# Altium project 2221_ProjetPCB.PrjPcb
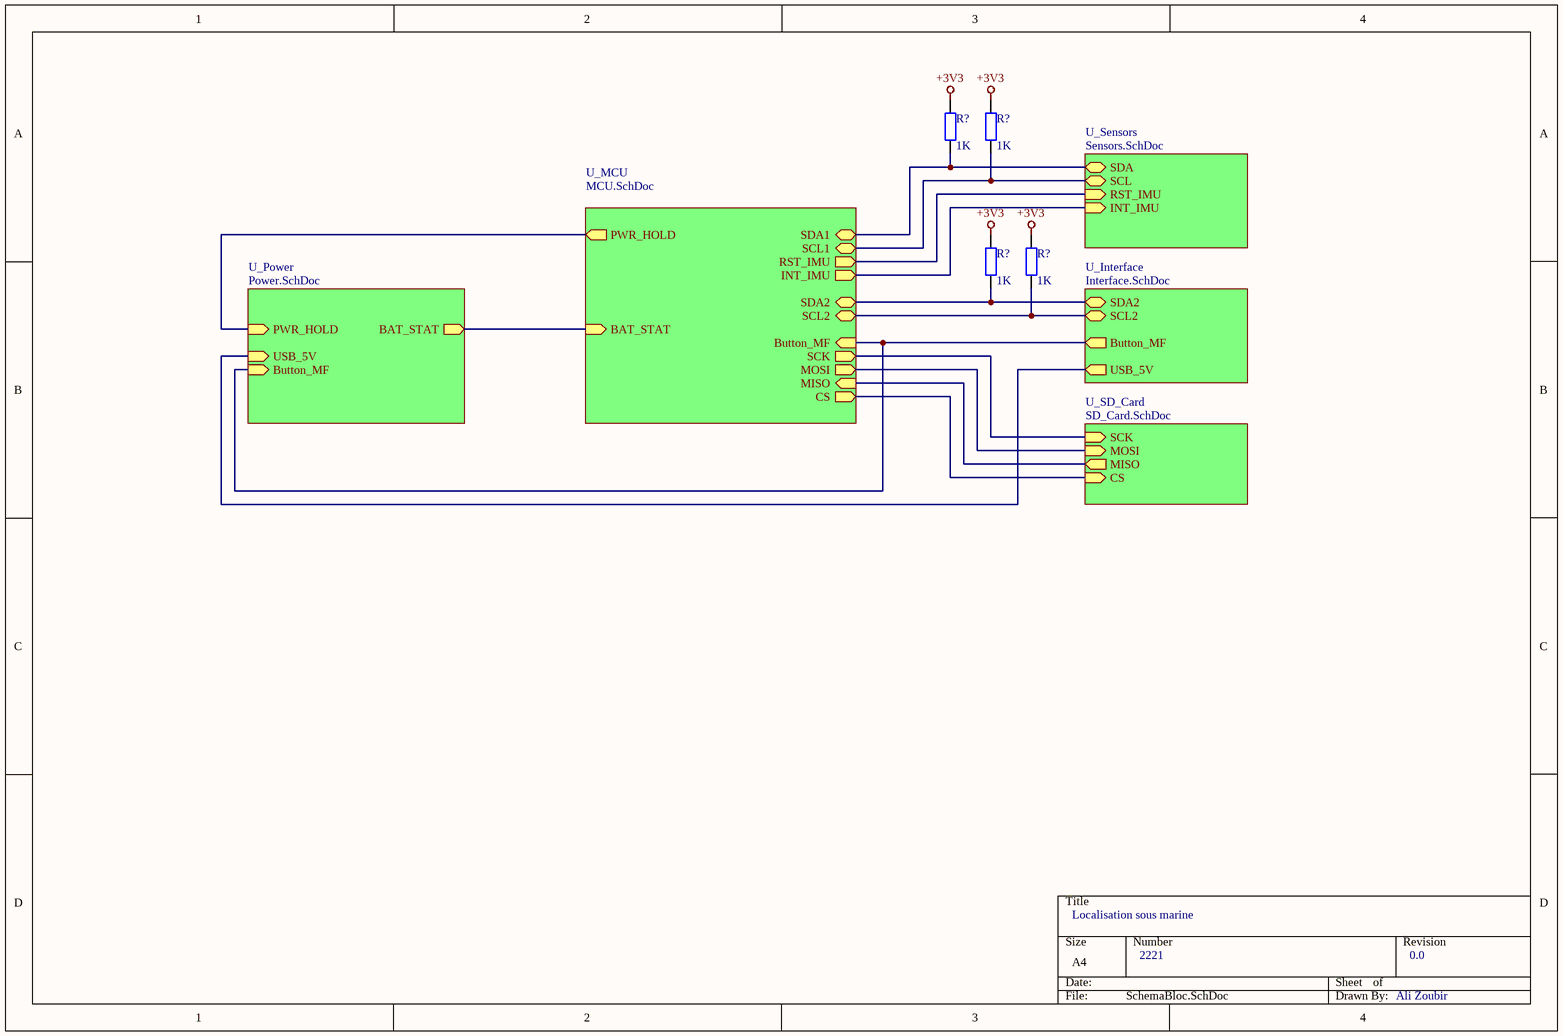
[diagram p0: SchemaBloc.SchDoc]
6 sheets, 33 parts. Net scope: hierarchical (ports join the sheet entries above them; power ports are global).
Sheets:
  SchemaBloc.SchDoc
    U_MCU = MCU.SchDoc
    U_Interface = Interface.SchDoc
    U_Power = Power.SchDoc
    U_SD_Card = SD_Card.SchDoc
    U_Sensors = Sensors.SchDoc

## Sheet SchemaBloc.SchDoc: Localisation sous marine
size A4; Author: Ali Zoubir; DrawnBy: Ali Zoubir; Engineer: Ali Zoubir; Organization: ETML-ES; Revision: 0.0; SheetNumber: 1; SheetTotal: 6

### Parts
(Parts that share a designator on the sheet are numbered #1, #2 ... from top to bottom, then left to right.)
R?#1  value 1K  [AXIAL-0.4]
R?#2  value 1K  [AXIAL-0.4]
R?#3  value 1K  [AXIAL-0.4]
R?#4  value 1K  [AXIAL-0.4]

### Sub-sheets
U_Interface = Interface.SchDoc: SDA2 (bidir), SCL2 (bidir), Button_MF (out), USB_5V (out)
U_MCU = MCU.SchDoc: SDA1 (bidir), SCL1 (bidir), Button_MF (in), SCK (out), MOSI (out), MISO (in), CS (out), BAT_STAT (in), RST_IMU (out), INT_IMU (out), PWR_HOLD (out), SDA2 (bidir), SCL2 (bidir)
U_Power = Power.SchDoc: BAT_STAT (out), PWR_HOLD (in), Button_MF (in), USB_5V (in)
U_SD_Card = SD_Card.SchDoc: SCK (in), MOSI (in), MISO (out), CS (in)
U_Sensors = Sensors.SchDoc: SDA (bidir), SCL (bidir), RST_IMU (in), INT_IMU (in)

### Nets
+3V3: R?#1.2 R?#2.2 R?#3.2 R?#4.2
RA0_CS: sheet U_MCU/CS, sheet U_SD_Card/CS
RA1_SCK: sheet U_MCU/SCK, sheet U_SD_Card/SCK
RA2_MOSI: sheet U_MCU/MOSI, sheet U_SD_Card/MOSI
RA3_MISO: sheet U_MCU/MISO, sheet U_SD_Card/MISO
RB2_SDA2: R?#4.1 ; sheet U_MCU/SCL2, sheet U_Interface/SCL2
RB3_SCL2: R?#3.1 ; sheet U_MCU/SDA2, sheet U_Interface/SDA2
RB6_RstImu: sheet U_MCU/RST_IMU, sheet U_Sensors/RST_IMU
RB7_IntImu: sheet U_MCU/INT_IMU, sheet U_Sensors/INT_IMU
RB8_SCL1: R?#2.1 ; sheet U_MCU/SCL1, sheet U_Sensors/SCL
RB9_SDA1: R?#1.1 ; sheet U_MCU/SDA1, sheet U_Sensors/SDA
RC0_ButtonMF: sheet U_MCU/Button_MF, sheet U_Interface/Button_MF, sheet U_Power/Button_MF
RC1_PwrHold: sheet U_MCU/PWR_HOLD, sheet U_Power/PWR_HOLD
RC2_BatStat: sheet U_MCU/BAT_STAT, sheet U_Power/BAT_STAT
(unnamed): sheet U_Interface/USB_5V, sheet U_Power/USB_5V

### Notes on the sheet
- 2221

### Library data of the parts
R?#1-R?#4 = Res2: Resistor; Published: 8-Jun-2000; LatestRevisionDate: 17-Jul-2002; LatestRevisionNote: Re-released for DXP Platform.; PackageReference: AXIAL-0.4; Publisher: Altium Limited; PackageDescription: Axial Device, Thru-Hole; 2 Leads; 0.4 in Pin Spacing

## Sheet MCU.SchDoc: Localisation sous marine
size A4; Author: Ali Zoubir; CompanyName: ETML-ES; Engineer: Ali Zoubir; Organization: ETML-ES; Revision: 0.0; SheetNumber: 2; SheetTotal: 6
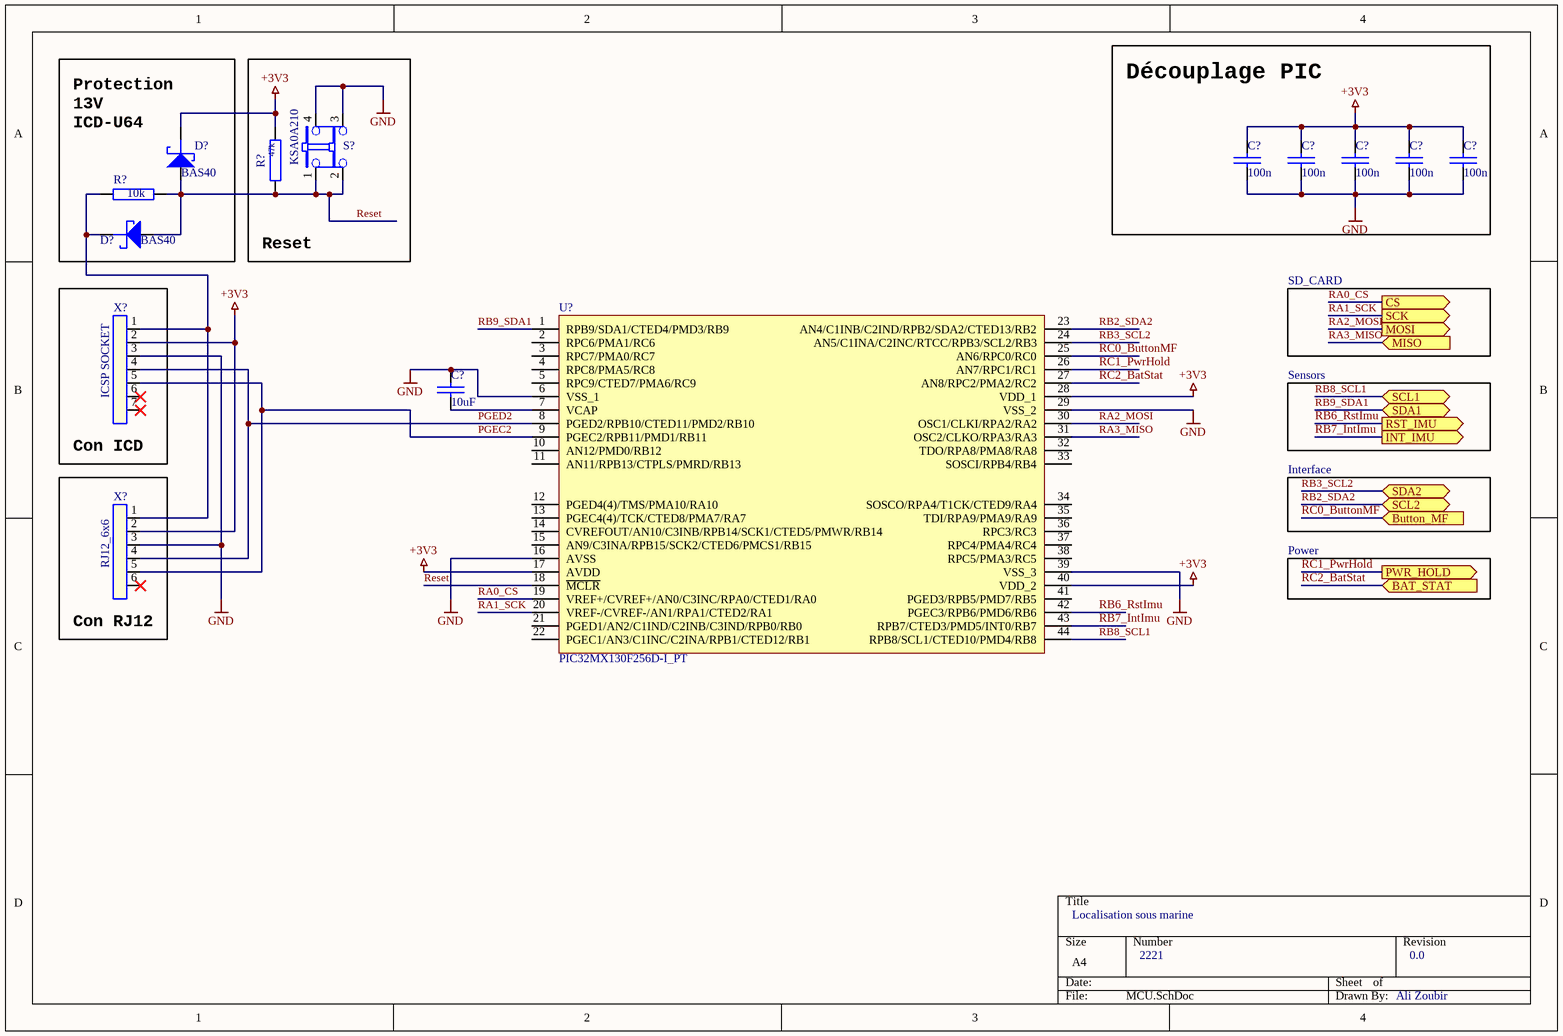
[diagram p1: MCU.SchDoc]

### Parts
(Parts that share a designator on the sheet are numbered #1, #2 ... from top to bottom, then left to right.)
C?#1  100n  [RC0805]
C?#2  100n  [RC0805]
C?#3  100n  [RC0805]
C?#4  100n  [RC0805]
C?#5  100n  [RC0805]
C?#6  10uF  [RC0805]
D?#1  BAS40  [BAS40]
D?#2  BAS40  [BAS40]
R?#5  47k  [RC0805]
R?#6  10k  [RC0805]
S?  KSA0A210  [6x6_mm_SMD_WS-TASV]
U?#1  PIC32MX130F256D-I_PT  [QFP80P1200X1200X120-44N]
X?#1  ICSP SOCKET  [Mini-berg1x7]
X?#2  RJ12_6x6  [RJ12_66_coude_verr_bas]

### Blocks framed on the sheet
Reset: R?#5 S?
Découplage PIC: C?#1-C?#5
Con ICD: X?#1
Con RJ12: X?#2

### Ports
BAT_STAT (in, see SchemaBloc[2B]), Button_MF (in, see SchemaBloc[3B], Interface[1A]), CS (out, see SchemaBloc[3B]), INT_IMU (out, see SchemaBloc[3B]), MISO (in, see SchemaBloc[3B]), MOSI (out, see SchemaBloc[3B]), PWR_HOLD (out, see SchemaBloc[2A]), RST_IMU (out, see SchemaBloc[3B]), SCK (out, see SchemaBloc[3B]), SCL1 (bidir, see SchemaBloc[3A]), SCL2 (bidir, see SchemaBloc[3B], Interface[1A]), SDA1 (bidir, see SchemaBloc[3A]), SDA2 (bidir, see SchemaBloc[3B], Interface[1A])

### Nets
+3V3: C?#1.1 C?#2.1 C?#3.1 C?#4.1 C?#5.1 D?#1.3(K) R?#5.1 U?#1.17(AVDD) U?#1.28(VDD_1) U?#1.40(VDD_2) X?#1.2 X?#2.2
GND: C?#1.2 C?#2.2 C?#3.2 C?#4.2 C?#5.2 C?#6.1 S?.3 S?.4 U?#1.6(VSS_1) U?#1.16(AVSS) U?#1.29(VSS_2) U?#1.39(VSS_3) X?#1.3 X?#2.3
PGEC2: U?#1.9(PGEC2/RPB11/PMD1/RB11) X?#1.5 X?#2.5
PGED2: U?#1.8(PGED2/RPB10/CTED11/PMD2/RB10) X?#1.4 X?#2.4
RA0_CS: U?#1.19(VREF+/CVREF+/AN0/C3INC/RPA0/CTED1/RA0) ; port CS
RA1_SCK: U?#1.20(VREF-/CVREF-/AN1/RPA1/CTED2/RA1) ; port SCK
RA2_MOSI: U?#1.30(OSC1/CLKI/RPA2/RA2) ; port MOSI
RA3_MISO: U?#1.31(OSC2/CLKO/RPA3/RA3) ; port MISO
RB2_SDA2: U?#1.23(AN4/C1INB/C2IND/RPB2/SDA2/CTED13/RB2) ; port SCL2
RB3_SCL2: U?#1.24(AN5/C1INA/C2INC/RTCC/RPB3/SCL2/RB3) ; port SDA2
RB6_RstImu: U?#1.42(PGEC3/RPB6/PMD6/RB6) ; port RST_IMU
RB7_IntImu: U?#1.43(RPB7/CTED3/PMD5/INT0/RB7) ; port INT_IMU
RB8_SCL1: U?#1.44(RPB8/SCL1/CTED10/PMD4/RB8) ; port SCL1
RB9_SDA1: U?#1.1(RPB9/SDA1/CTED4/PMD3/RB9) ; port SDA1
RC0_ButtonMF: U?#1.25(AN6/RPC0/RC0) ; port Button_MF
RC1_PwrHold: U?#1.26(AN7/RPC1/RC1) ; port PWR_HOLD
RC2_BatStat: U?#1.27(AN8/RPC2/PMA2/RC2) ; port BAT_STAT
Reset: D?#1.1(A) D?#2.1(A) R?#5.2 R?#6.2 S?.1 S?.2 U?#1.18(~{MCLR})
NetC?#6_2: C?#6.2 U?#1.7(VCAP)
NetD?#2_3: D?#2.3(K) R?#6.1 X?#1.1 X?#2.1

Not connected (* = marked no-connect by the designer): U?#1 2(RPC6/PMA1/RC6) 3(RPC7/PMA0/RC7) 4(RPC8/PMA5/RC8) 5(RPC9/CTED7/PMA6/RC9) 10(AN12/PMD0/RB12) 11(AN11/RPB13/CTPLS/PMRD/RB13) 12(PGED4(4)/TMS/PMA10/RA10) 13(PGEC4(4)/TCK/CTED8/PMA7/RA7) 14(CVREFOUT/AN10/C3INB/RPB14/SCK1/CTED5/PMWR/RB14) 15(AN9/C3INA/RPB15/SCK2/CTED6/PMCS1/RB15) 21(PGED1/AN2/C1IND/C2INB/C3IND/RPB0/RB0) 22(PGEC1/AN3/C1INC/C2INA/RPB1/CTED12/RB1) 32(TDO/RPA8/PMA8/RA8) 33(SOSCI/RPB4/RB4) 34(SOSCO/RPA4/T1CK/CTED9/RA4) 35(TDI/RPA9/PMA9/RA9) 36(RPC3/RC3) 37(RPC4/PMA4/RC4) 38(RPC5/PMA3/RC5) 41(PGED3/RPB5/PMD7/RB5); X?#1 6* 7*; X?#2 6*

### Notes on the sheet
- (near D?#1) Protection
  13V
  ICD-U64
- SD_CARD
- Sensors
- Interface
- Power
- 2221

### Library data of the parts
C?#1-C?#6 = C: SDTSourceLibName: C:\WINDOWS\TEMP\DA.LIB; PCB Footprint: RC0805
D?#1 D?#2 = BAS40_0: NC: 2; PCB Footprint: BAS40
R?#5 = R: SDTSourceLibName: N:\APP\ORCADWIN\EXPRESS\LIBRARY\ETML_LIB\R_FILMME; COMPSIDE: TOP; COMPLOC: [850.000,-625.000]; COMPROT: 270; COMPGROUP: 0; COMPFIXED: NO; COMPHEIGHT: 0.000; PCB Footprint: RC0805; COMPLOCKED: NO; COMPKEY: NO; DECOUPLER: NO; MEMORY: NO
R?#6 = R: SDTSourceLibName: N:\APP\ORCADWIN\EXPRESS\LIBRARY\ETML_LIB\R_FILMME; COMPHEIGHT: 0.000; MEMORY: NO; COMPGROUP: 0; COMPROT: 270; COMPLOC: [4375.000,-300.000]; COMPSIDE: TOP; PCB Footprint: RC0805; DECOUPLER: NO; COMPKEY: NO; COMPLOCKED: NO; COMPFIXED: NO
U?#1 = PIC32MX130F256D-I_PT: Microchip PIC32MX130F256D-I/PT, 32bit PIC Microcontroller, 40MHz, 256 kB Flash, 44-Pin TQFP; Geometry.Height: 1.2mm; Mouser Part Number: 579-MX130F256DIPT; Mouser Price/Stock: https://www.mouser.co.uk/ProductDetail/Microchip-Technology/PIC32MX130F256D-I-PT?qs=XR%2FfMt4sL%252BEhDQElh0Q%2FjQ%3D%3D; Manufacturer_Name: Microchip; Manufacturer_Part_Number: PIC32MX130F256D-I/PT; Datasheet Link: https://componentsearchengine.com/Datasheets/5/PIC32MX130F256D-I_PT.pdf
X?#1 = Berg 7p: COMPSIDE: TOP; COMPLOC: [5575.000,-150.000]; COMPROT: 0; COMPFIXED: NO; COMPHEIGHT: 10.000; COMPGROUP: 0; COMPLOCKED: NO; COMPKEY: NO; DECOUPLER: NO; MEMORY: NO; PCB Footprint: Mini-berg1x7
X?#2 = RJ12: COMPSIDE: TOP; COMPLOC: [5225.000,-550.000]; COMPROT: 0; COMPFIXED: NO; COMPHEIGHT: 0.000; COMPGROUP: 0; COMPLOCKED: NO; COMPKEY: NO; DECOUPLER: NO; MEMORY: NO; PCB Footprint: RJ12_66_coude_verr_bas
S? = KSA0A210: PCB Footprint: 6x6_mm_SMD_WS-TASV

## Sheet Interface.SchDoc
size A4; SheetNumber: 4; SheetTotal: 6
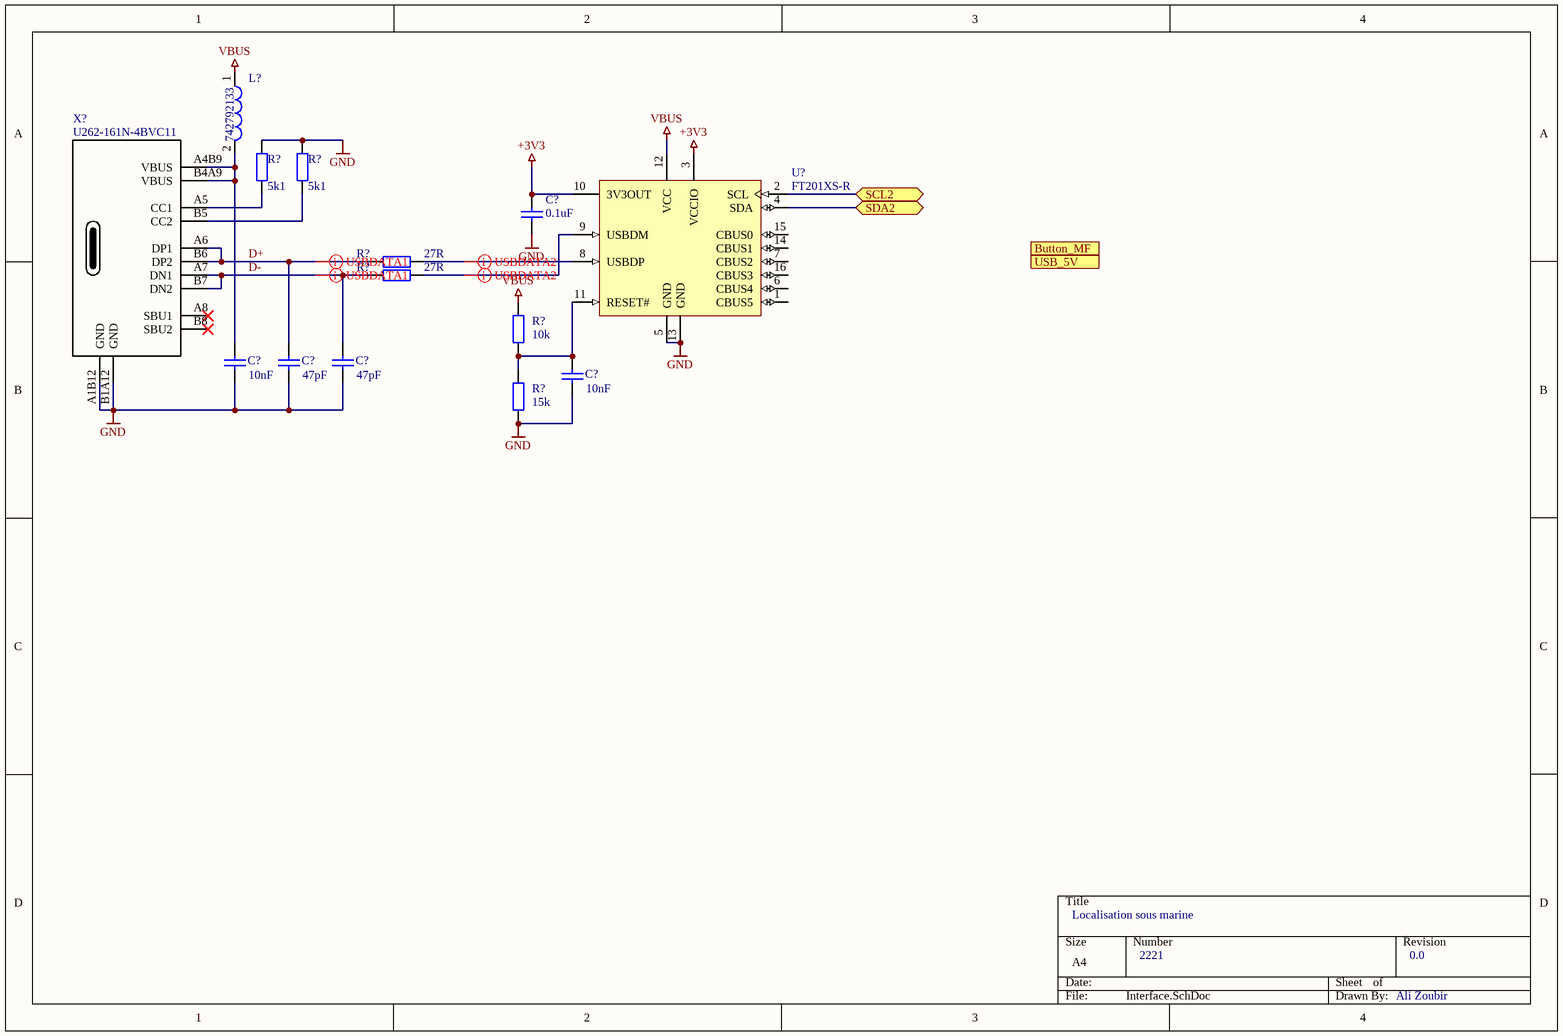
[diagram p2: Interface.SchDoc]

### Parts
(Parts that share a designator on the sheet are numbered #1, #2 ... from top to bottom, then left to right.)
C?#7  value 0.1uF  [6-0805_L]  (hidden comment: Cap)
C?#8  value 10nF  [6-0805_L]  (hidden comment: Cap)
C?#9  value 47pF  [6-0805_L]  (hidden comment: Cap)
C?#10  value 47pF  [6-0805_L]  (hidden comment: Cap)
C?#11  value 10nF  [6-0805_L]  (hidden comment: Cap)
L?  742792133  [SMD-1206]
R?#7  value 5k1  [AXIAL-0.4]  (hidden comment: Res2)
R?#8  value 5k1  [AXIAL-0.4]  (hidden comment: Res2)
R?#9  value 27R  [AXIAL-0.4]  (hidden comment: Res2)
R?#10  value 27R  [AXIAL-0.4]  (hidden comment: Res2)
R?#11  value 10k  [AXIAL-0.4]  (hidden comment: Res2)
R?#12  value 15k  [AXIAL-0.4]  (hidden comment: Res2)
U?#2  FT201XS-R  [SSOP-16_N]
X?#3  U262-161N-4BVC11  [GCT_USB4105-GF-A]

### Ports
Button_MF (out, see SchemaBloc[3B], MCU[4C]), SCL2 (bidir, see SchemaBloc[3B], MCU[4B]), SDA2 (bidir, see SchemaBloc[3B], MCU[4B]), USB_5V (out, see SchemaBloc[3B])

### Nets
+3V3: C?#7.2 U?#2.3(VCCIO) U?#2.10(3V3OUT)
GND: C?#7.1 C?#8.1 C?#9.1 C?#10.1 C?#11.1 R?#7.2 R?#8.2 R?#12.1 U?#2.5(GND) U?#2.13(GND) X?#3.A1B12(GND) X?#3.B1A12(GND)
VBUS: L?.1 R?#11.2 U?#2.12(VCC)
D+: C?#9.2 R?#9.1 X?#3.A6(DP1) X?#3.B6(DP2)
D-: C?#10.2 R?#10.1 X?#3.A7(DN1) X?#3.B7(DN2)
RB2_SDA2: U?#2.2(SCL) ; port SCL2
RB3_SCL2: U?#2.4(SDA) ; port SDA2
NetC?#8_2: C?#8.2 L?.2 X?#3.A4B9(VBUS) X?#3.B4A9(VBUS)
NetC?#11_2: C?#11.2 R?#11.1 R?#12.2 U?#2.11(RESET#)
NetR?#7_1: R?#7.1 X?#3.A5(CC1)
NetR?#8_1: R?#8.1 X?#3.B5(CC2)
NetR?#9_2: R?#9.2 U?#2.8(USBDP)
NetR?#10_2: R?#10.2 U?#2.9(USBDM)

Not connected (* = marked no-connect by the designer): U?#2 1(CBUS5) 6(CBUS4) 7(CBUS2) 14(CBUS1) 15(CBUS0) 16(CBUS3); X?#3 A8(SBU1)* B8(SBU2)*

### Layout directives
differential pair: D+, D-, NetR?#9_2, NetR?#10_2

### Notes on the sheet
- Localisation sous marine
- 2221
- 0.0
- Ali Zoubir

### Library data of the parts
C?#7-C?#11 = Cap: Capacitor; Published: 8-Jun-2000; LatestRevisionDate: 17-Jul-2002; LatestRevisionNote: Re-released for DXP Platform.; PackageReference: RAD-0.3; Publisher: Altium Limited; PackageDescription: Radial Cap, Thru-Hole; 2 Leads; 0.3 in Pin Spacing
L? = CMP-0220-00010-1: SMD EMI Suppression Ferrite Bead WE-CBF, Z = 600 Ohm; Impedance: 600 Ohm; ComponentLink1Description: Manufacturer Link; DatasheetVersion: ver 2, Aug-2007; ComponentLink1URL: http://www.we-online.com; PackageDescription: Chip Inductor, 2-Leads, Body 3.2 x 1.6 mm; ComponentLink2URL: http://www.we-online.de/katalog/media/pdf/742792133.pdf; PackageVersion: 2007; PackageReference: SMD-1206; ComponentLink2Description: Datasheet
R?#7-R?#12 = Res2: Resistor; Published: 8-Jun-2000; LatestRevisionDate: 17-Jul-2002; LatestRevisionNote: Re-released for DXP Platform.; PackageReference: AXIAL-0.4; Publisher: Altium Limited; PackageDescription: Axial Device, Thru-Hole; 2 Leads; 0.4 in Pin Spacing
U?#2 = CMP-0248-00019-2: USB to I2C Interface Slave Chip, UHCI/OHCI/EHCI Compatible, USB 2.0 Compatible, -40 to +85 degC, 16-Pin SSOP, Pb-Free, Tape and Reel; Manufacturer: FTDI; PartNumber: FT201XS-R; DatasheetVersion: ver 1.3, Feb-2013; ComponentLink1Description: Manufacturer URL; ComponentLink1URL: http://www.ftdichip.com/; PackageDescription: 16-Pin Small Outline Package, 8.6 x 3.9 mm Body, 0.635 mm Pitch; ComponentLink3URL: www.ftdichip.com/Products/ICs/FT201X.html; RevisionNote: DatasheetVersion updated to 1.3 Feb-2013; PackageReference: SSOP-16; Code_JEDEC: MO-137-AB; ComponentLink2Description: Datasheet; ComponentLink3Description: FT201X Product Page; ComponentLink2URL: http://www.ftdichip.com/Support/Documents/DataSheets/ICs/DS_FT201X.pdf; PackageVersion: Feb-13
X?#3 = USB-C Type 2.0: U262-161N-4BVC11 / XKB Connectivity; ComponentLink1Description: LCSC  C319148; ComponentLink1URL: https://lcsc.com/product-detail/USB-Connectors_XKB-Connectivity-U262-161N-4BVC11_C319148.html; Supplier 1: LCSC; Supplier Part Number 1: C319148

## Sheet Power.SchDoc
size A4; SheetNumber: 7; SheetTotal: 7
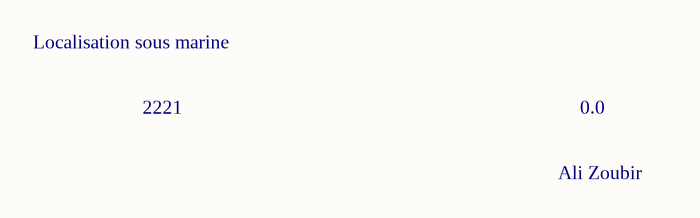
[diagram p3: Power.SchDoc]

### Notes on the sheet
- Localisation sous marine
- 2221
- 0.0
- Ali Zoubir

## Sheet SD_Card.SchDoc
size A4; SheetNumber: 3; SheetTotal: 7
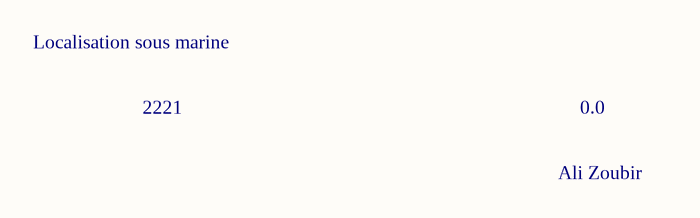
[diagram p4: SD_Card.SchDoc]

### Notes on the sheet
- Localisation sous marine
- 2221
- 0.0
- Ali Zoubir

## Sheet Sensors.SchDoc
size A4; SheetNumber: 6; SheetTotal: 7
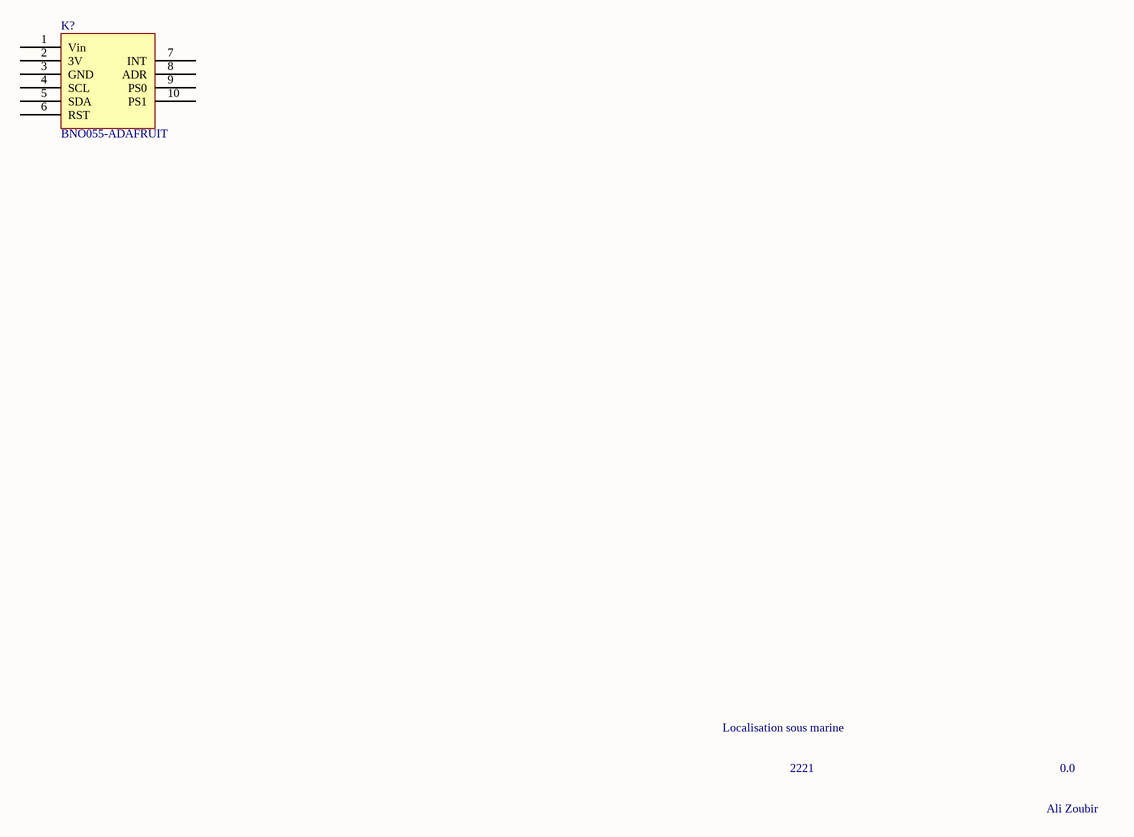
[diagram p5: Sensors.SchDoc]

### Parts
K?  BNO055-ADAFRUIT

### Nets

Not connected (* = marked no-connect by the designer): K? 1(Vin) 2(3V) 3(GND) 4(SCL) 5(SDA) 6(RST) 7(INT) 8(ADR) 9(PS0) 10(PS1)

### Notes on the sheet
- Localisation sous marine
- 2221
- 0.0
- Ali Zoubir

## Nets that join several sheets
+3V3: SchemaBloc (R?#1.2 R?#2.2 R?#3.2 R?#4.2), MCU (12 pins), Interface (C?#7.2 U?#2.3 U?#2.10)
GND: MCU (14 pins), Interface (12 pins)
RB2_SDA2: SchemaBloc (R?#4.1), MCU (U?#1.23), Interface (U?#2.2)
RB3_SCL2: SchemaBloc (R?#3.1), MCU (U?#1.24), Interface (U?#2.4)
RB8_SCL1: SchemaBloc (R?#2.1), MCU (U?#1.44)
RB9_SDA1: SchemaBloc (R?#1.1), MCU (U?#1.1)